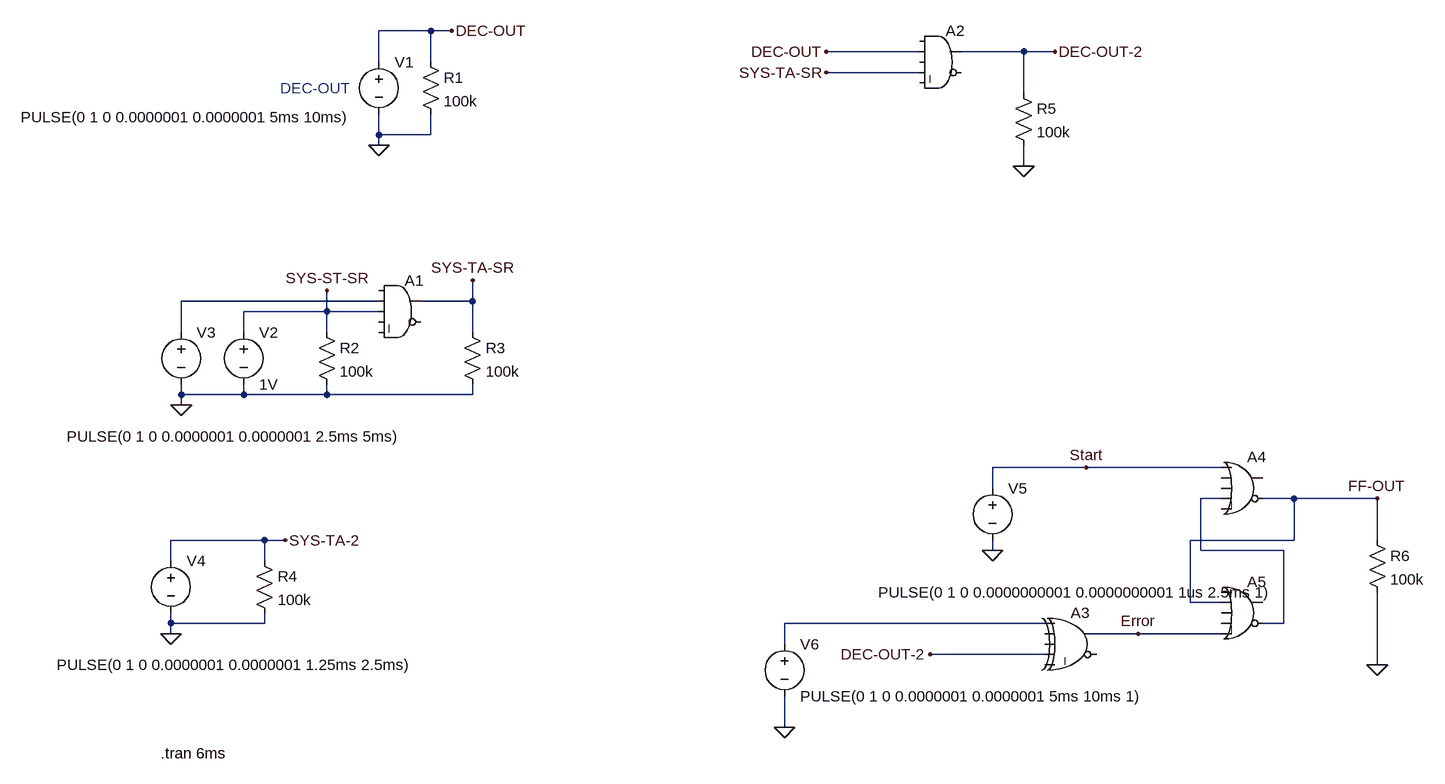
[diagram p0: schematic Draft1.asc]
Draft1.asc, the LTspice schematic file:
Version 4
SHEET 1 880 808
WIRE -816 -528 -896 -528
WIRE -784 -528 -816 -528
WIRE -64 -496 -208 -496
WIRE 96 -496 0 -496
WIRE 144 -496 96 -496
WIRE -896 -480 -896 -528
WIRE -816 -480 -816 -528
WIRE -64 -464 -208 -464
WIRE 96 -432 96 -496
WIRE -896 -368 -896 -400
WIRE -816 -368 -816 -400
WIRE -816 -368 -896 -368
WIRE -896 -352 -896 -368
WIRE 96 -320 96 -352
WIRE -896 -112 -1200 -112
WIRE -752 -112 -752 -144
WIRE -752 -112 -832 -112
WIRE -976 -96 -976 -128
WIRE -976 -96 -1104 -96
WIRE -896 -96 -976 -96
WIRE -1200 -64 -1200 -112
WIRE -1104 -64 -1104 -96
WIRE -976 -64 -976 -96
WIRE -752 -64 -752 -112
WIRE -1200 32 -1200 16
WIRE -1104 32 -1104 16
WIRE -1104 32 -1200 32
WIRE -976 32 -976 16
WIRE -976 32 -1104 32
WIRE -752 32 -752 16
WIRE -752 32 -976 32
WIRE -1200 48 -1200 32
WIRE 192 144 48 144
WIRE 400 144 192 144
WIRE 48 176 48 144
WIRE 400 192 368 192
WIRE 512 192 464 192
WIRE 640 192 512 192
WIRE -1072 256 -1216 256
WIRE -1040 256 -1072 256
WIRE 512 256 512 192
WIRE 512 256 352 256
WIRE 640 256 640 192
WIRE 48 272 48 256
WIRE 368 272 368 192
WIRE 496 272 368 272
WIRE -1216 288 -1216 256
WIRE -1072 288 -1072 256
WIRE 352 352 352 256
WIRE 400 352 352 352
WIRE -1216 384 -1216 368
WIRE -1072 384 -1072 368
WIRE -1072 384 -1216 384
WIRE 128 384 -272 384
WIRE 496 384 496 272
WIRE 496 384 464 384
WIRE -1216 400 -1216 384
WIRE 272 400 192 400
WIRE 400 400 272 400
WIRE -272 416 -272 384
WIRE 128 432 -48 432
WIRE 640 448 640 336
WIRE -272 544 -272 496
FLAG -896 -352 0
FLAG -784 -528 DEC-OUT
FLAG -1200 48 0
FLAG -976 -128 SYS-ST-SR
FLAG -752 -144 SYS-TA-SR
FLAG -1216 400 0
FLAG -1040 256 SYS-TA-2
FLAG -208 -496 DEC-OUT
FLAG -208 -464 SYS-TA-SR
FLAG 96 -320 0
FLAG 144 -496 DEC-OUT-2
FLAG -48 432 DEC-OUT-2
FLAG 640 448 0
FLAG 48 272 0
FLAG -272 544 0
FLAG 192 144 Start
FLAG 272 400 Error
FLAG 640 192 FF-OUT
SYMBOL voltage -896 -496 R0
WINDOW 3 -551 101 Left 2
WINDOW 123 0 0 Left 0
WINDOW 39 0 0 Left 0
SYMATTR InstName V1
SYMATTR Value PULSE(0 1 0 0.0000001 0.0000001 5ms 10ms)
SYMBOL res -832 -496 R0
SYMATTR InstName R1
SYMATTR Value 100k
SYMBOL voltage -1104 -80 R0
WINDOW 123 0 0 Left 0
WINDOW 39 0 0 Left 0
SYMATTR InstName V2
SYMATTR Value 1V
SYMBOL Digital\\and -864 -160 R0
SYMATTR InstName A1
SYMBOL voltage -1200 -80 R0
WINDOW 3 -176 176 Left 2
WINDOW 123 0 0 Left 0
WINDOW 39 0 0 Left 0
SYMATTR InstName V3
SYMATTR Value PULSE(0 1 0 0.0000001 0.0000001 2.5ms 5ms)
SYMBOL res -992 -80 R0
SYMATTR InstName R2
SYMATTR Value 100k
SYMBOL res -768 -80 R0
SYMATTR InstName R3
SYMATTR Value 100k
SYMBOL voltage -1216 272 R0
WINDOW 3 -176 176 Left 2
WINDOW 123 0 0 Left 0
WINDOW 39 0 0 Left 0
SYMATTR InstName V4
SYMATTR Value PULSE(0 1 0 0.0000001 0.0000001 1.25ms 2.5ms)
SYMBOL res -1088 272 R0
SYMATTR InstName R4
SYMATTR Value 100k
SYMBOL Digital\\and -32 -544 R0
SYMATTR InstName A2
SYMBOL res 80 -448 R0
SYMATTR InstName R5
SYMATTR Value 100k
SYMBOL Digital\\xor 176 352 R0
SYMATTR InstName A3
SYMBOL Digital\\or 432 112 R0
SYMATTR InstName A4
SYMBOL Digital\\or 432 304 R0
SYMATTR InstName A5
SYMBOL res 624 240 R0
SYMATTR InstName R6
SYMATTR Value 100k
SYMBOL voltage 48 160 R0
WINDOW 3 -176 176 Left 2
WINDOW 123 0 0 Left 0
WINDOW 39 0 0 Left 0
SYMATTR InstName V5
SYMATTR Value PULSE(0 1 0 0.0000000001 0.0000000001 1us 2.5ms 1)
SYMBOL voltage -272 400 R0
WINDOW 123 0 0 Left 0
WINDOW 39 0 0 Left 0
SYMATTR InstName V6
SYMATTR Value PULSE(0 1 0 0.0000001 0.0000001 5ms 10ms 1)
TEXT -1232 584 Left 2 !.tran 6ms
TEXT -1048 -440 Left 2 ;DEC-OUT

The netlist it stands for:
* Draft1.asc
V1 DEC-OUT 0 PULSE(0 1 0 0.0000001 0.0000001 5ms 10ms)
R1 DEC-OUT 0 100k
V2 SYS-ST-SR 0 1V
A1 0 N001 SYS-ST-SR 0 0 0 SYS-TA-SR 0 AND
V3 N001 0 PULSE(0 1 0 0.0000001 0.0000001 2.5ms 5ms)
R2 SYS-ST-SR 0 100k
R3 SYS-TA-SR 0 100k
V4 SYS-TA-2 0 PULSE(0 1 0 0.0000001 0.0000001 1.25ms 2.5ms)
R4 SYS-TA-2 0 100k
A2 0 DEC-OUT 0 SYS-TA-SR 0 0 DEC-OUT-2 0 AND
R5 DEC-OUT-2 0 100k
A3 N003 0 0 DEC-OUT-2 0 0 Error 0 XOR
A4 Start 0 0 N002 0 FF-OUT 0 0 OR
A5 0 FF-OUT 0 0 Error N002 0 0 OR
R6 FF-OUT 0 100k
V5 Start 0 PULSE(0 1 0 0.0000000001 0.0000000001 1us 2.5ms 1)
V6 N003 0 PULSE(0 1 0 0.0000001 0.0000001 5ms 10ms 1)
.tran 6ms
* DEC-OUT
.backanno
.end

* Results of the author's LTspice run, read from the files saved beside the schematic
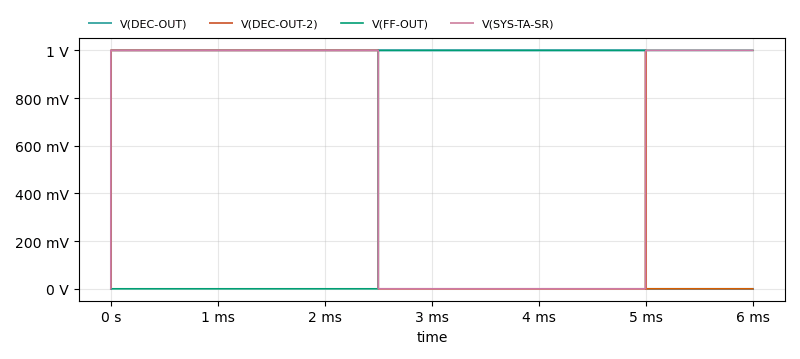
[diagram p1: Transient Analysis of Draft1.asc, plotted from the saved traces]
* Transient Analysis, 1 run:
*   V(DEC-OUT): min 0 V, max 1 V, average 833 mV, rms 912.7 mV, last 0 V
*   V(DEC-OUT-2): min 0 V, max 1 V, average 416.5 mV, rms 645.4 mV, last 0 V
*   V(FF-OUT): min 0 V, max 1 V, average 583.5 mV, rms 763.9 mV, last 1 V
*   V(SYS-TA-SR): min 0 V, max 1 V, average 583.5 mV, rms 763.9 mV, last 1 V